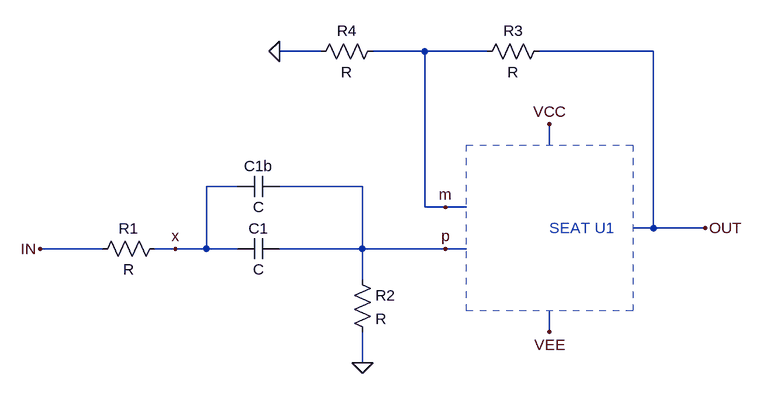
[diagram p0: schematic FO_HP_ni.asc]
FO_HP_ni.asc, the LTspice schematic file:
Version 4.1
SHEET 1 980 680
WIRE 320 -64 256 -64
WIRE 480 -64 400 -64
WIRE 576 -64 480 -64
WIRE 832 -64 656 -64
WIRE 672 80 672 48
WIRE 192 144 144 144
WIRE 384 144 256 144
WIRE 480 176 480 -64
WIRE 512 176 480 176
WIRE 544 176 512 176
WIRE 832 208 832 -64
WIRE 832 208 800 208
WIRE 912 208 832 208
WIRE -16 240 -112 240
WIRE 96 240 64 240
WIRE 144 240 144 144
WIRE 144 240 96 240
WIRE 192 240 144 240
WIRE 384 240 384 144
WIRE 384 240 256 240
WIRE 512 240 384 240
WIRE 544 240 512 240
WIRE 384 288 384 240
WIRE 672 368 672 336
WIRE 384 416 384 368
FLAG 912 208 OUT
FLAG 672 48 VCC
FLAG 672 368 VEE
FLAG 512 176 m
FLAG 512 240 p
FLAG -112 240 IN
FLAG 384 416 0
FLAG 256 -64 0
FLAG 96 240 x
SYMBOL res 80 224 R90
WINDOW 0 0 56 VBottom 2
WINDOW 3 32 56 VTop 2
SYMATTR InstName R1
SYMBOL res 672 -80 R90
WINDOW 0 0 56 VBottom 2
WINDOW 3 32 56 VTop 2
SYMATTR InstName R3
SYMBOL res 368 272 R0
SYMATTR InstName R2
SYMBOL res 416 -80 R90
WINDOW 0 0 56 VBottom 2
WINDOW 3 32 56 VTop 2
SYMATTR InstName R4
SYMBOL cap 256 128 R90
WINDOW 3 32 32 VTop 2
WINDOW 0 0 32 VBottom 2
SYMATTR InstName C1b
SYMBOL cap 256 224 R90
WINDOW 0 0 32 VBottom 2
WINDOW 3 32 32 VTop 2
SYMATTR InstName C1
TEXT 672 208 Left 2 ;SEAT U1
RECTANGLE Normal 544 80 800 336 2

The netlist it stands for:
* FO_HP_ni.asc
R1 x IN R
R3 OUT m R
R2 p 0 R
R4 m 0 R
C1b p x C
C1 p x C
* SEAT U1
.backanno
.end